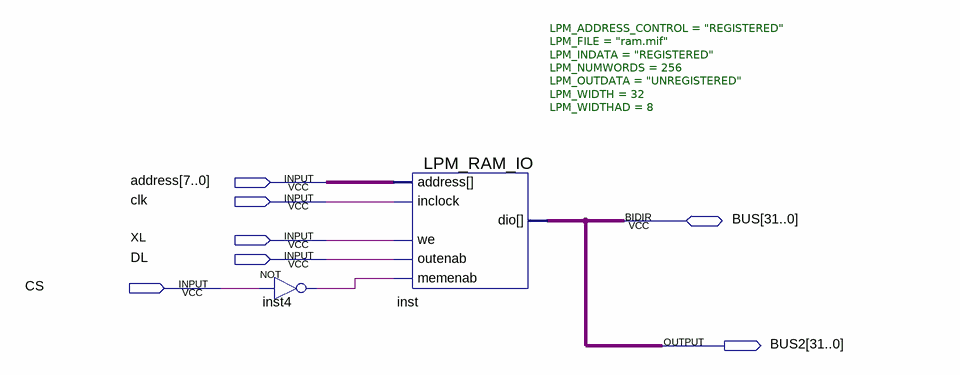
[diagram p0: schematic sheet]
// Quartus schematic RAM_.bdf as structural Verilog: 2 symbols, 7 pins
module RAM_ (
  input  [7:0] address,
  input  clk,
  input  XL,
  input  DL,
  input  CS,
  inout  [31:0] BUS,
  output [31:0] BUS2
);

  wire inst4_out;

  not inst4 (inst4_out, CS);
  LPM_RAM_IO #(.LPM_ADDRESS_CONTROL("REGISTERED"), .LPM_FILE("ram.mif"), .LPM_INDATA("REGISTERED"), .LPM_NUMWORDS(256), .LPM_OUTDATA("UNREGISTERED"), .LPM_WIDTH(32), .LPM_WIDTHAD(8)) inst (
    .address(address), .memenab(inst4_out), .inclock(clk), .we(XL), .outenab(DL), .dio(BUS));

  assign BUS2 = BUS;
endmodule
